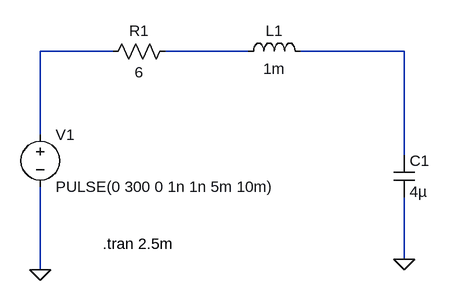
[diagram p0: schematic CircuitoRLC.asc]
CircuitoRLC.asc, the LTspice schematic file:
Version 4.1
SHEET 1 880 680
WIRE 112 -32 0 -32
WIRE 320 -32 192 -32
WIRE 560 -32 400 -32
WIRE 0 96 0 -32
WIRE 560 128 560 -32
WIRE 560 288 560 192
WIRE 0 304 0 176
FLAG 0 304 0
FLAG 560 288 0
SYMBOL voltage 0 80 R0
WINDOW 123 0 0 Left 0
WINDOW 39 0 0 Left 0
SYMATTR InstName V1
SYMATTR Value PULSE(0 300 0 1n 1n 5m 10m)
SYMBOL cap 544 128 R0
SYMATTR InstName C1
SYMATTR Value 4µ
SYMBOL res 208 -48 R90
WINDOW 0 0 56 VBottom 2
WINDOW 3 32 56 VTop 2
SYMATTR InstName R1
SYMATTR Value 6
SYMBOL ind 304 -16 R270
WINDOW 0 32 56 VTop 2
WINDOW 3 5 56 VBottom 2
SYMATTR InstName L1
SYMATTR Value 1m
SYMATTR SpiceLine Rser=1m
TEXT 96 264 Left 2 !.tran 2.5m

The netlist it stands for:
* CircuitoRLC.asc
V1 N001 0 PULSE(0 300 0 1n 1n 5m 10m)
C1 N003 0 4µ
R1 N002 N001 6
L1 N002 N003 1m Rser=1m
.tran 2.5m
.backanno
.end